# EasyEDA Pro project ptc.eprj

# Schematic Schematic1
Create Date: 2024-10-08; Page Name: P1; Project Name: New Project_2024-10-08_14-39-28; Schematic Name: Schematic1; Update Date: 2024-10-08; Add into BOM: yes; Convert to PCB: yes
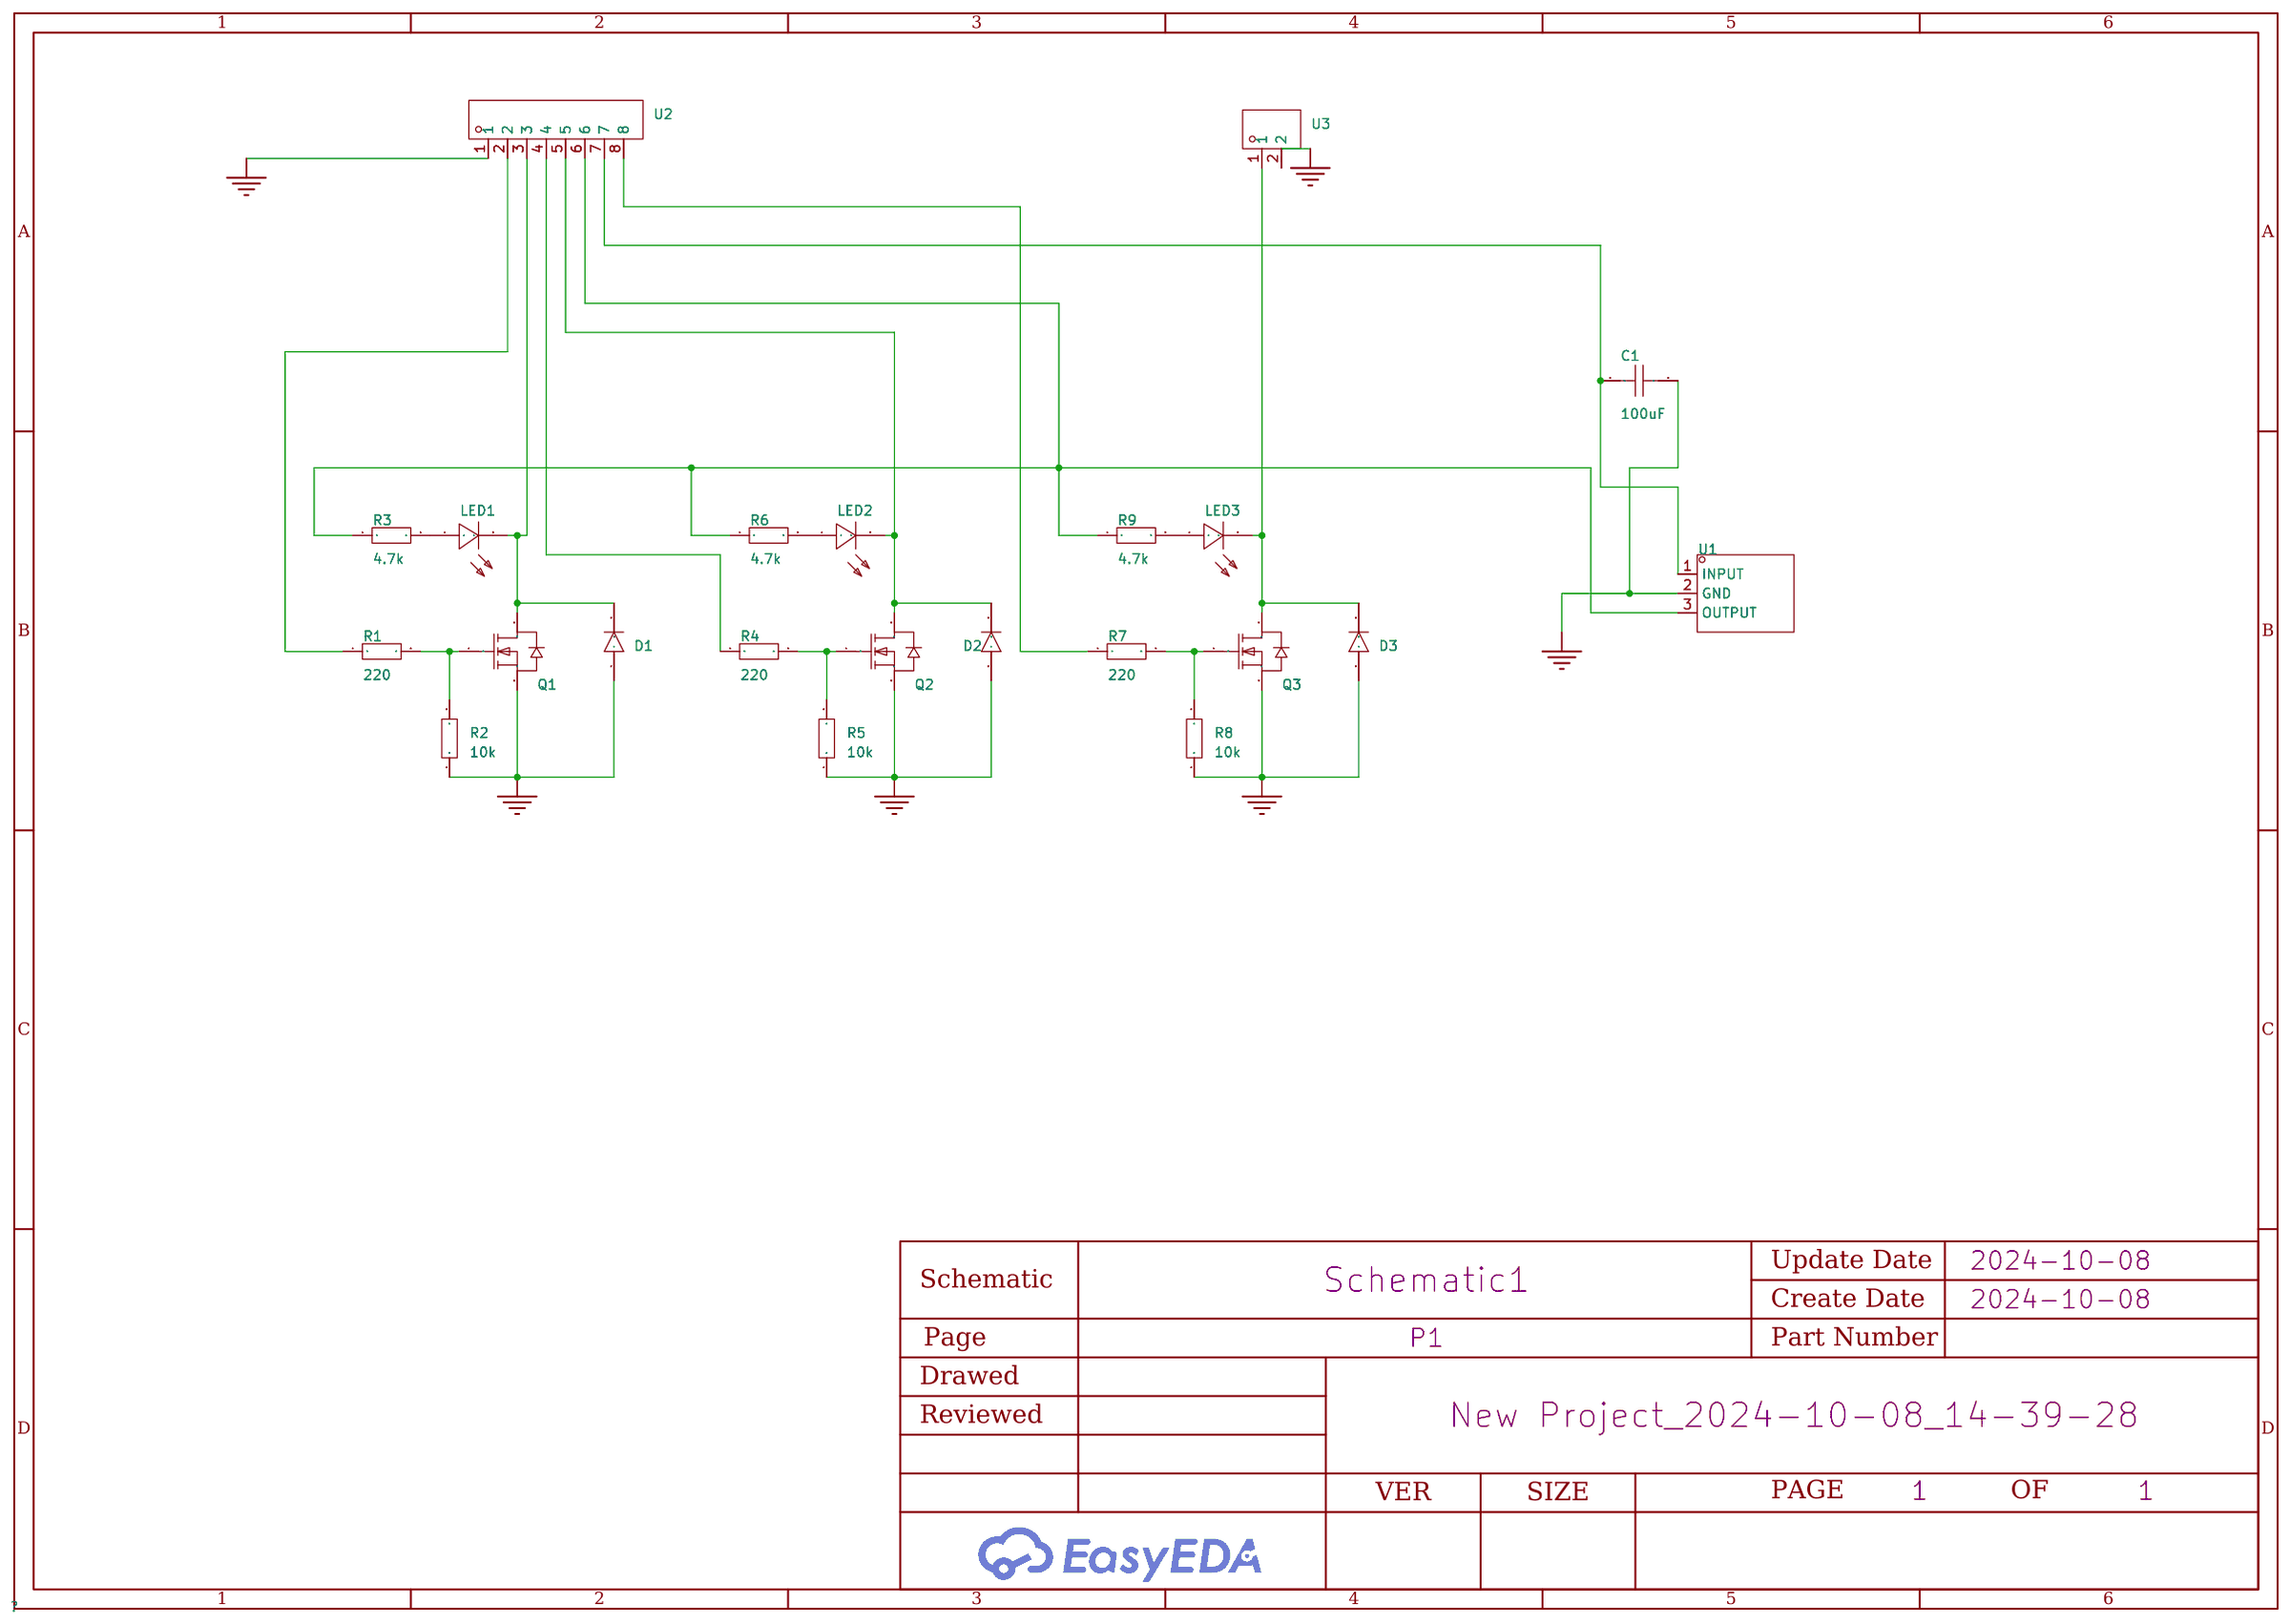
[diagram p0: schematic sheet]

## Parts
C1  100uF  [CAP-TH_BD8.0-P3.50-D0.6-FD]
D1  -  [DO-41_BD2.4-L4.7-P8.70-D0.9-RD]
D2  -  [DO-41_BD2.4-L4.7-P8.70-D0.9-RD]
D3  -  [DO-41_BD2.4-L4.7-P8.70-D0.9-RD]
LED1  -  [LED-TH_BD5.9-P2.54-RD_RED]
LED2  -  [LED-TH_BD5.9-P2.54-RD_RED]
LED3  -  [LED-TH_BD5.9-P2.54-RD_RED]
Q1  -  [TO-220-3_L10.0-W4.5-P2.54-L]
Q2  -  [TO-220-3_L10.0-W4.5-P2.54-L]
Q3  -  [TO-220-3_L10.0-W4.5-P2.54-L]
R1  220  [RES-TH_BD1.9-L3.3-P7.30-D0.5]
R2  10k  [RES-TH_BD1.9-L3.3-P7.30-D0.5]
R3  4.7k  [Res_1/8W]
R4  220  [RES-TH_BD1.9-L3.3-P7.30-D0.5]
R5  10k  [RES-TH_BD1.9-L3.3-P7.30-D0.5]
R6  4.7k  [Res_1/8W]
R7  220  [RES-TH_BD1.9-L3.3-P7.30-D0.5]
R8  10k  [RES-TH_BD1.9-L3.3-P7.30-D0.5]
R9  4.7k  [Res_1/8W]
U1  -  [TO-220AB-3_L10.4-W4.6-P2.54-T]
U2  -  [CONN-TH_8P-P5.00_DB128V-5.0-8P]
U3  -  [CONN-TH_2P-P5.00_DB128V-5.0-2P]

## Library data of the parts
C1 = CAP_0603: Supplier Footprint: 0603
D1-D3 = 1N4007: Diode Configuration: Reverse Voltage (Vr): Average Rectified Current (Io): Forward Voltage (Vf@If):1.1V@1A Reverse Leakage Current:5μA@1kV; LCSC Part Name: 1kV 1A 1.1V@1A; Supplier Part: C84641; Manufacturer: 星海; Supplier Footprint: DO-41; JLCPCB Part Class: Extended Part; Datasheet: https://atta.szlcsc.com/upload/public/pdf/source/20171026/C84641_15089842760411059271.pdf; Supplier: LCSC; Forward Voltage (Vf@If): 1.1V@1A; Reverse Leakage Current: 5μA@1kV
LED1-LED3 = TJ-S1608SW6TGLC2R-A5: Emitted Color:红灯 Diode Configuration:- Lens Color:Colorless transparence Dominant Wavelength:620nm~630nm Dominant Wavelength:620nm~630nm Peak Wavelength:625nm Color Temperature:- Color Temperature:- Luminous Flux (@25℃):- Forward Current:20mA Forward Voltage (VF):2.4V Luminous Intensity:120mcd Power Dissipation:72mW Viewing Angle:120° Mounting Sytle:- Operating Temperature:-40℃~+80℃ Operating Temperature:-40℃~+80℃; LCSC Part Name: 红光; Supplier Part: C192315; Manufacturer: TOGIALED(台湾统佳); Supplier Footprint: 0603; JLCPCB Part Class: Extended Part; Datasheet: https://atta.szlcsc.com/upload/public/pdf/source/20180531/C192315_50539816642E07971684D99631CE590B.pdf; Supplier: LCSC; Emitted Color: 红灯; Lens Color: Colorless transparence; Dominant Wavelength: 620nm~630nm; Peak Wavelength: 625nm; Forward Current: 20mA; Forward Voltage (VF): 2.4V; Luminous Intensity: 120mcd; Power Dissipation: 72mW; Viewing Angle: 120°; Operating Temperature: -40℃~+80℃
Q1-Q3 = IRFZ44NPBF: Type: Drain Source Voltage (Vdss): Continuous Drain Current (Id): Power Dissipation (Pd): Drain Source On Resistance (RDS(on)@Vgs,Id):17.5mΩ@10V,25A Gate Threshold Voltage (Vgs(th)@Id):4V@250μA; LCSC Part Name: N沟道 55V 49A; Supplier Part: C2586; Manufacturer: Infineon(英飞凌); Supplier Footprint: TO-220(TO-220-3); JLCPCB Part Class: Extended Part; Datasheet: https://atta.szlcsc.com/upload/public/pdf/source/20120403/1457706463862.pdf; Supplier: LCSC; Drain Source On Resistance (RDS(on)@Vgs,Id): 17.5mΩ@10V,25A; Gate Threshold Voltage (Vgs(th)@Id): 4V@250μA
R1 R2 R4 R5 R7 R8 = MFR0W8F1002A50: Type:Metal Film Resistors Resistance: Tolerance:±1% Tolerance:±1% Power(Watts):125mW Temperature Coefficient:±50ppm/℃ Temperature Coefficient:±50ppm/℃; LCSC Part Name: 10kΩ ±1% 125mW; Supplier Part: C58673; Manufacturer: UNI-ROYAL(厚声); Supplier Footprint: 轴向引线; JLCPCB Part Class: Extended Part; Datasheet: https://atta.szlcsc.com/upload/public/pdf/source/20170615/1497511065493.pdf; Supplier: LCSC; Type: Metal Film Resistors; Tolerance: ±1%; Power(Watts): 125mW; Temperature Coefficient: ±50ppm/℃
R3 R6 R9 = Res_0603: Supplier Footprint: 0603
U1 = MC7812BDTG: Output Type: Output Polarity:Positive Number of Outputs:1 Maximum Input Voltage:35V Output Voltage:12V~12V Output Voltage:12V~12V Dropout Voltage:2V@(1A) Output Current:1A Power Supply Rejection Ratio (PRSS):60dB@(1kHz); LCSC Part Name: Vin=35V Vout=12V 1A 60dB@(1kHz); Supplier Part: C233216; Manufacturer: onsemi(安森美); Supplier Footprint: TO-252-2(DPAK); JLCPCB Part Class: Extended Part; Datasheet: https://atta.szlcsc.com/upload/public/pdf/source/20180629/C233216_E0D00B173AB53A12EF92D161353A8E8C.PDF; Supplier: LCSC; Output Polarity: Positive; Number of Outputs: 1; Maximum Input Voltage: 35V; Output Voltage: 12V~12V; Dropout Voltage: 2V@(1A); Output Current: 1A; Power Supply Rejection Ratio (PRSS): 60dB@(1kHz)
U2 = DB128V-5.0-8P-GN-S: Pitch:5mm Number of Rows:1 Number of PINs Per Row:8 Mounting Style:直针 Current Rating (Max):20A Voltage Rating (Max):300V Wire Gauge - AWG:12~30 Wire Gauge - mm?:2.5 Operating Temperature Range:-40℃~+105℃ Operating Temperature Range:-40℃~+105℃ Color:Green; LCSC Part Name: 5mm 排数:1 每排P数:8 直针; Supplier Part: C395863; Manufacturer: DIBO(地博电气); Supplier Footprint: P=5mm; JLCPCB Part Class: Extended Part; Datasheet: https://atta.szlcsc.com/upload/public/pdf/source/20211103/827C302C67D946C37BD30C6F2B47D268.pdf; Supplier: LCSC; Pitch: 5mm; Number of Rows: 1; Number of PINs Per Row: 8; Mounting Style: 直针; Current Rating (Max): 20A; Voltage Rating (Max): 300V; Wire Gauge - AWG: 12~30; Wire Gauge - mm?: 2.5; Operating Temperature Range: -40℃~+105℃; Color: Green
U3 = DB128V-5.0-2P-GN-S: Pitch:5mm Number of Rows:1 Number of PINs Per Row:2 Mounting Style:直针 Current Rating (Max):20A Voltage Rating (Max):300V Wire Gauge - AWG:12~30 Wire Gauge - mm?:2.5 Operating Temperature Range:-40℃~+105℃ Operating Temperature Range:-40℃~+105℃ Color:Green; LCSC Part Name: 5mm 排数:1 每排P数:2 直针; Supplier Part: C395860; Manufacturer: DIBO(地博电气); Supplier Footprint: P=5mm; JLCPCB Part Class: Extended Part; Datasheet: https://atta.szlcsc.com/upload/public/pdf/source/20211103/827C302C67D946C37BD30C6F2B47D268.pdf; Supplier: LCSC; Pitch: 5mm; Number of Rows: 1; Number of PINs Per Row: 2; Mounting Style: 直针; Current Rating (Max): 20A; Voltage Rating (Max): 300V; Wire Gauge - AWG: 12~30; Wire Gauge - mm?: 2.5; Operating Temperature Range: -40℃~+105℃; Color: Green

## Nets
GND: C1.2 D1.2(A) D2.2(A) D3.2(A) Q1.3(S) Q2.3(S) Q3.3(S) R2.1 R5.1 R8.1 U1.2(GND) U2.1 U3.2
$1N262: Q1.1(G) R1.2 R2.2
$1N1005: LED1.1(A) R3.2
$1N1320: Q2.1(G) R4.2 R5.2
$1N1324: LED2.1(A) R6.2
$1N1563: Q3.1(G) R7.2 R8.2
$1N1567: LED3.1(A) R9.2
$1N2583: R1.1 U2.2
$1N2589: D1.1(C) LED1.2(K) Q1.2(D) U2.3
$1N2604: R4.1 U2.4
$1N2611: D2.1(C) LED2.2(K) Q2.2(D) U2.5
$1N2670: D3.1(C) LED3.2(K) Q3.2(D) U3.1
$1N2757: R7.1 U2.8
$1N2769: C1.1 U1.1(INPUT) U2.7
$1N2799: R3.1 R6.1 R9.1 U1.3(OUTPUT) U2.6

# Board PCB1
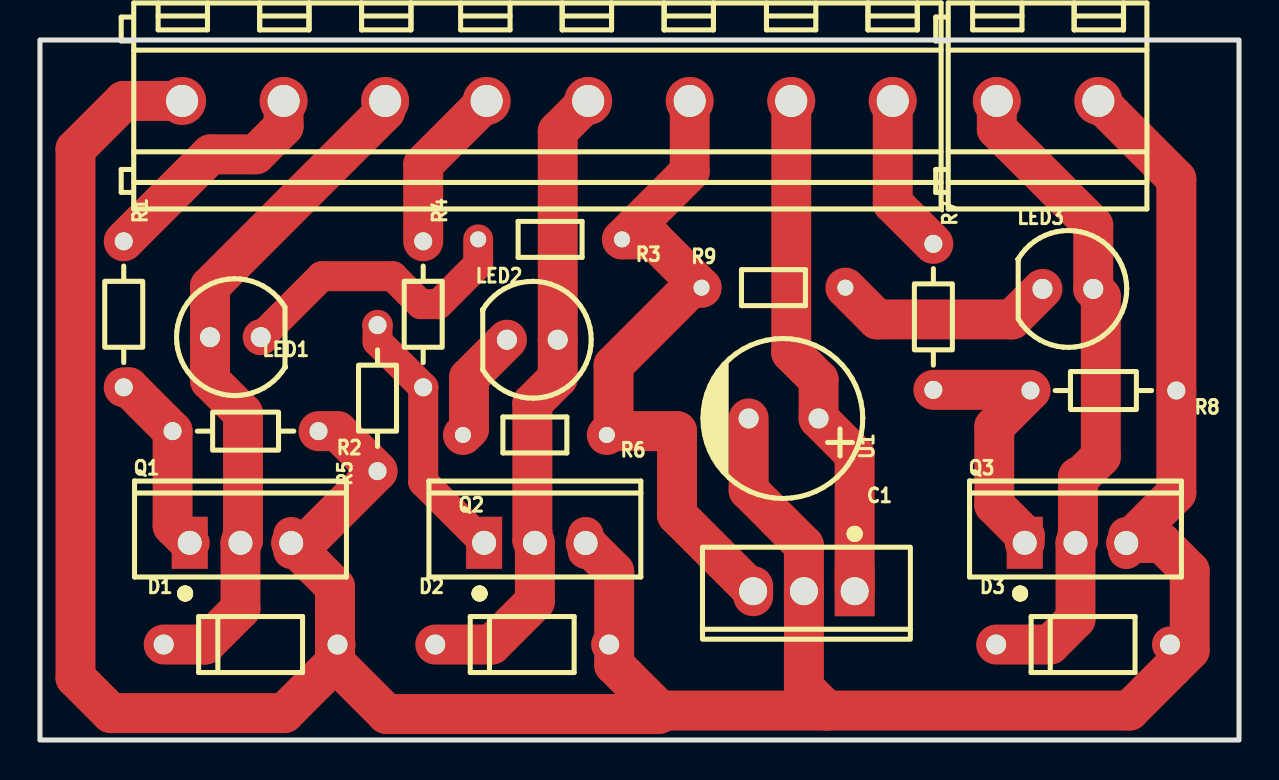
[diagram p1: board, top side]
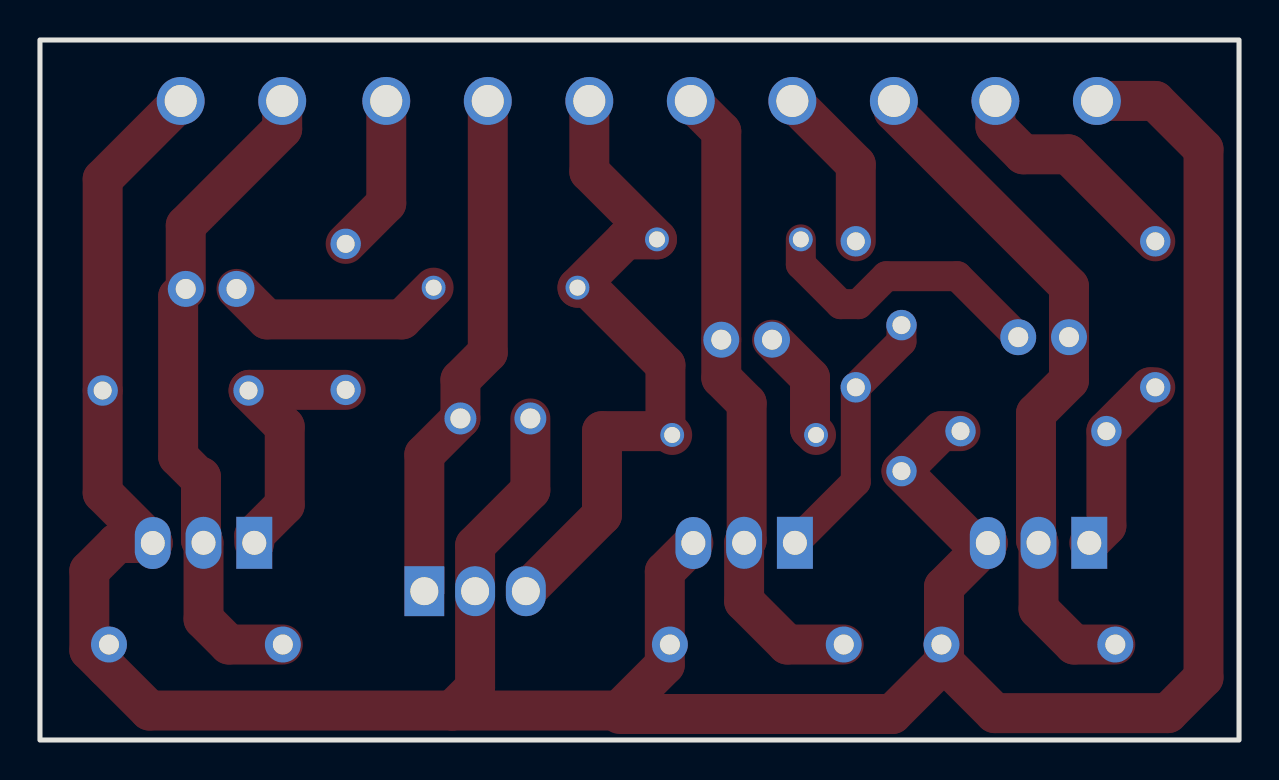
[diagram p2: board, bottom side, seen from below]

Outline 60 x 35 mm; copper layers: Top Layer, Bottom Layer. Coordinates in mm from the lower left corner of the outline.
Outline path: rectangle 0,35 60,0
Stack: Top Layer 0.035mm / Dielectric1 1.51mm FR4 er 4.5 / Bottom Layer 0.035mm

## Design rules (mm)
template: JLCPCB Capability(Two Layers Board)
spacing copperThickness1oz (default): track to track 0.102, other pairs 0.152 to 0.3
spacing copperThickness2oz: track to track 0.203, other pairs 0.152 to 0.3
track width copperThickness1oz (default): min 0.127, default 0.254, max 2.54
track width copperThickness2oz: min 0.203, default 0.254, max 2.54
differential pair differentialPair (default): width min 0.127, default 0.254, max 2.54; gap min 0.152, default 0.152
via viaSize (default): diameter min 0.5, default 0.61, max 10; hole min 0.3, default 0.305, max 6.3

## Placement (name value [footprint] x y rotation side)
C1  100uF  [CAP-TH_BD8.0-P3.50-D0.6-FD]  37.21 16.08 180 top
D1  -  [DO-41_BD2.4-L4.7-P8.70-D0.9-RD]  10.54 4.77 0 top
D2  -  [DO-41_BD2.4-L4.7-P8.70-D0.9-RD]  24.13 4.77 0 top
D3  -  [DO-41_BD2.4-L4.7-P8.70-D0.9-RD]  52.2 4.77 0 top
LED1  -  [LED-TH_BD5.9-P2.54-RD_RED]  9.78 20.14 180 top
LED2  -  [LED-TH_BD5.9-P2.54-RD_RED]  24.64 20.01 0 top
LED3  -  [LED-TH_BD5.9-P2.54-RD_RED]  51.43 22.55 0 top
Q1  -  [TO-220-3_L10.0-W4.5-P2.54-L]  10.03 9.85 0 top
Q2  -  [TO-220-3_L10.0-W4.5-P2.54-L]  24.77 9.85 0 top
Q3  -  [TO-220-3_L10.0-W4.5-P2.54-L]  51.82 9.85 0 top
R1  220  [RES-TH_BD1.9-L3.3-P7.30-D0.5]  4.19 21.28 270 top
R2  10k  [RES-TH_BD1.9-L3.3-P7.30-D0.5]  10.29 15.44 180 top
R3  4.7k  [Res_1/8W]  25.53 25.09 180 top
R4  220  [RES-TH_BD1.9-L3.3-P7.30-D0.5]  19.18 21.28 270 top
R5  10k  [RES-TH_BD1.9-L3.3-P7.30-D0.5]  16.89 17.09 90 top
R6  4.7k  [Res_1/8W]  24.77 15.31 180 top
R7  220  [RES-TH_BD1.9-L3.3-P7.30-D0.5]  44.7 21.16 270 top
R8  10k  [RES-TH_BD1.9-L3.3-P7.30-D0.5]  53.21 17.47 180 top
R9  4.7k  [Res_1/8W]  36.7 22.55 0 top
U1  -  [TO-220AB-3_L10.4-W4.6-P2.54-T]  38.23 7.44 270 top
U2  -  [CONN-TH_8P-P5.00_DB128V-5.0-8P]  24.89 31.95 0 top
U3  -  [CONN-TH_2P-P5.00_DB128V-5.0-2P]  50.42 31.95 0 top

## Footprints (pads in the part's own frame, mm; a bottom-side part is the same pattern mirrored in y, then rotated)
CAP-TH_BD8.0-P3.50-D0.6-FD
  round 1.6 hole 1: 1(-1.75,0) 2(1.75,0)
CONN-TH_2P-P5.00_DB128V-5.0-2P
  round 2.401 hole 1.6: 1(-2.54,0) 2(2.54,0)
CONN-TH_8P-P5.00_DB128V-5.0-8P
  round 2.401 hole 1.6: 1(-17.78,0) 2(-12.7,0) 3(-7.62,0) 4(-2.54,0) 5(2.54,0) 6(7.62,0) 7(12.7,0) 8(17.78,0)
DO-41_BD2.4-L4.7-P8.70-D0.9-RD
  round 1.8 hole 1: 1(-4.35,0) 2(4.35,0)
LED-TH_BD5.9-P2.54-RD_RED
  round 1.8 hole 1: 1(-1.27,0) 2(1.27,0)
RES-TH_BD1.9-L3.3-P7.30-D0.5
  round 1.524 hole 0.899: 1(-3.65,0) 2(3.65,0)
Res_1/8W
  round 1.199 hole 0.8: 1(-3.599,0.063) 2(3.599,0.063)
TO-220-3_L10.0-W4.5-P2.54-L
  rect 1.801x2.601 hole 1.199: 1(-2.54,0.005)
  oval 1.801x2.601 hole 1.199: 2(0,0.005) 3(2.54,-0.005)
TO-220AB-3_L10.4-W4.6-P2.54-T
  rect 2.499x1.999 hole 1.399: 1(0,2.54)
  oval 2.499x1.999 hole 1.399: 2(0,0) 3(0,-2.54)

## Nets
As in the schematic.

## Routing (per net, layer and track width the routed paths; a pad name or vN(x,y) marks a point on that pad's centre or on a via; arc(x,y) is an arc through that point)
GND: length 167.7
  Top Layer w2: 30.99,1.3 17.35,1.3 14.76,3.89 ; U3.2 56.86,28.05 R8.1 56.86,12.36 Q3.3 56.14,9.85 57.53,8.46 57.53,4.49 54.52,1.47 39.37,1.47 ; Q2.3 28.73,8.42 28.73,3.76 31.02,1.47 39.37,1.47 ; R2.1 14.89,15.44 R5.1 13.3,9.85 Q1.3 14.76,7.66 14.76,3.89 ; U2.1 4.19,31.95 1.78,29.54 1.78,3.12 3.56,1.34 12.22,1.34 14.76,3.89 ; 39.37,1.47 38.23,2.61 U1.2 38.23,9.73 35.46,12.49 C1.2
$1N262: length 9.3
  Top Layer w2: Q1.1 6.64,10.72 R2.2 4.44,17.63 R1.2
$1N1005: length 14.8
  Top Layer w1.5: LED1.1 14.1,23.19 17.65,23.19 19.05,21.79 19.94,21.79 21.93,23.78 21.93,25.03
$1N1320: length 13.1
  Top Layer w1.5: Q2.1 19.18,12.91 R4.2 16.89,19.92 R5.2
$1N1324: length 5.7
  Top Layer w2: LED2.1 21.47,18.11 21.47,15.55 R6.2
$1N1563: length 13.9
  Top Layer w2: 44.7,17.51 49.53,17.51 R8.2 47.75,15.66 47.75,11.76 49.28,10.23 Q3.1
$1N1567: length 11.2
  Top Layer w2: 40.3,22.62 41.89,21.03 48.64,21.03 LED3.1
$1N2583: length 11.7
  Top Layer w2: U2.2 12.19,30.68 10.8,29.28 8.54,29.28 R1.1
$1N2589: length 34.3
  Top Layer w2: U2.3 17.27,31.44 8.51,22.68 LED1.2 8.51,17.98 10.16,16.33 10.16,9.99 Q1.2 10.03,6.55 8.25,4.77 D1.1
$1N2604: length 8.3
  Top Layer w2: U2.4 19.18,28.78 R4.1
$1N2611: length 32.1
  Top Layer w2: U2.5 25.91,30.43 LED2.2 25.91,18.11 24.64,16.84 24.64,9.99 Q2.2 24.77,6.93 22.61,4.77 D2.1
$1N2670: length 33.2
  Top Layer w2: D3.1 50.55,4.77 51.82,6.04 Q3.2 51.94,9.99 51.94,13.16 52.07,13.16 53.09,14.17 53.09,22.17 LED3.2 52.7,25.73 47.88,30.56 U3.1
$1N2757: length 8
  Top Layer w2: R7.1 42.67,26.84 U2.8
$1N2769: length 25.8
  Top Layer w2: U2.7 37.59,19.38 38.96,18.01 C1.1 40.77,14.27 U1.1
$1N2799: length 35.8
  Top Layer w2: 28.55,15.44 31.88,15.44 31.88,11.25 U1.3 ; 28.55,15.44 R6.1 ; 28.55,15.44 28.7,15.59 28.7,18.74 32.58,22.62 R9.1 30.69,25.03 29.13,25.03 32.51,28.42 U2.6
